# Altium schematic sheet PWM_PART.SchDoc
size A4
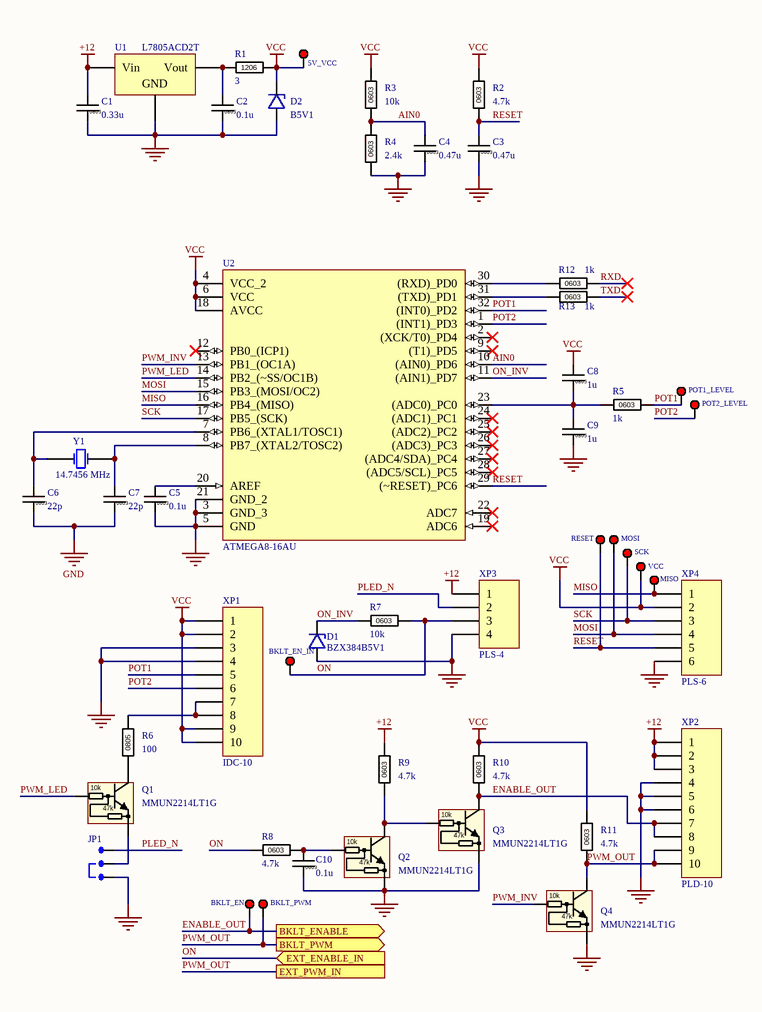
[diagram p0: PWM_PART.SchDoc]

## Parts
C1  Cap: 0.33u  Foot: 0805  [CAP_0805]  (hidden comment: 0805-X7R-100-0.33 мкф K)
C2  Cap: 0.1u  Foot: 0805  [CAP_0805]  (hidden comment: 0805-X7R-50-0.1 мкф K Hitano)
C3  Cap: 0.47u  Foot: 0603  [CAP_0603]  (hidden comment: 0603-X7R-50-0.47 мкф)
C4  Cap: 0.47u  Foot: 0603  [CAP_0603]  (hidden comment: 0603-X7R-50-0.47 мкф)
C5  Cap: 0.1u  Foot: 0603  [CAP_0603]  (hidden comment: 0603-X7R-50-0.1 мкф)
C6  Cap: 22p  Foot: 0603  [CAP_0603]  (hidden comment: 0603-NP0-50-22 пф F)
C7  Cap: 22p  Foot: 0603  [CAP_0603]  (hidden comment: 0603-NP0-50-22 пф F)
C8  Cap: 1u  Foot: 0805  [CAP_0805]  (hidden comment: 0805-X7R-50-1 мкф)
C9  Cap: 1u  Foot: 0805  [CAP_0805]  (hidden comment: 0805-X7R-50-1 мкф)
C10  Cap: 0.1u  Foot: 0603  [CAP_0603]  (hidden comment: 0603-X7R-50-0.1 мкф)
D1  BZX384B5V1  [SOD_323 (SC-76)]
D2  value B5V1  [SOD_323 (SC-76)]  (hidden comment: BZX384B5V1)
JP1  (no value)  [CONN_JUMPER 3PIN 2.54MM]
Q1  MMUN2214LT1G  [SOT_23]
Q2  MMUN2214LT1G  [SOT_23]
Q3  MMUN2214LT1G  [SOT_23]
Q4  MMUN2214LT1G  [SOT_23]
R1  value 3  Foot: 1206  [resistor_1206]  (hidden comment: 1206-3 J)
R2  value 4.7k  Foot: 0603  [resistor_0603]  (hidden comment: 0603-4.7 к J)
R3  value 10k  Foot: 0603  [resistor_0603]  (hidden comment: 0603-10к J)
R4  value 2.4k  Foot: 0603  [resistor_0603]  (hidden comment: 0603-2.4 к F)
R5  value 1k  Foot: 0603  [RESistor_0603]  (hidden comment: 0603-1 к J)
R6  value 100  Foot: 0805  [resistor_0805]  (hidden comment: 0805-100 J)
R7  value 10k  Foot: 0603  [resistor_0603]  (hidden comment: 0603-10к J)
R8  value 4.7k  Foot: 0603  [resistor_0603]  (hidden comment: 0603-4.7 к J)
R9  value 4.7k  Foot: 0603  [resistor_0603]  (hidden comment: 0603-4.7 к J)
R10  value 4.7k  Foot: 0603  [resistor_0603]  (hidden comment: 0603-4.7 к J)
R11  value 4.7k  Foot: 0603  [resistor_0603]  (hidden comment: 0603-4.7 к J)
R12  value 1k  Foot: 0603  [RESistor_0603]  (hidden comment: 0603-1 к J)
R13  value 1k  Foot: 0603  [RESistor_0603]  (hidden comment: 0603-1 к J)
TP1  5V_VCC  [OTHER_SMD_TP_1.5MM]
TP2  MISO  [OTHER_SMD_TP_1.5MM]
TP3  VCC  [OTHER_SMD_TP_1.5MM]
TP4  SCK  [OTHER_SMD_TP_1.5MM]
TP5  MOSI  [OTHER_SMD_TP_1.5MM]
TP6  RESET  [OTHER_SMD_TP_1.5MM]
TP7  BKLT_EN  [OTHER_SMD_TP_1.5MM]
TP8  BKLT_PWM  [OTHER_SMD_TP_1.5MM]
TP9  BKLT_EN_IN  [OTHER_SMD_TP_1.5MM]
TP10  POT1_LEVEL  [OTHER_SMD_TP_1.5MM]
TP11  POT2_LEVEL  [OTHER_SMD_TP_1.5MM]
U1  L7805ACD2T  [D2-PAK]
U2  ATMEGA8-16AU  [TQFP_32]
XP1  IDC-10  [CONN_IDC-10]
XP2  PLD-10  [CONN_PLD-10]
XP3  PLS-4  [CONN_PLS-4]
XP4  PLS-6  [CONN_PLD-6]
Y1  14.7456 MHz  [CRYSTAL_HC-49S]

## Ports
BKLT_ENABLE (out), BKLT_PWM (out), EXT_ENABLE_IN (in), EXT_PWM_IN

## Nets
+12: C1.1 R9.2 U1.1(Vin) XP2.1 XP2.2 XP2.3 XP3.1
GND: C1.2 C2.2 C3.2 C4.2 C5.2 C6.2 C7.2 C9.2 C10.2 D1.A D2.A JP1.1 Q2.2(E) Q3.2(E) Q4.2(E) R4.1 U1.2(GND) U2.3(GND_3) U2.5(GND) U2.21(GND_2) XP1.3 XP1.4 XP2.4 XP2.5 XP2.6 XP3.4 XP4.6
VCC: C8.1 D2.C R1.2 R2.2 R3.2 R10.2 R11.2 TP1.1 TP3.1 U2.4(VCC_2) U2.6(VCC) U2.18(AVCC) XP1.1 XP1.2 XP1.9 XP1.10 XP4.2
AIN0: C4.1 R3.1 R4.2 U2.10((AIN0)_PD6)
ENABLE_OUT: Q3.3(C) R10.1 TP7.1 XP2.7 XP2.8 ; port BKLT_ENABLE
MISO: TP2.1 U2.16(PB4_(MISO)) XP4.1
MOSI: TP5.1 U2.15(PB3_(MOSI/OC2)) XP4.4
ON: R7.2 R8.1 TP9.1 XP3.3 ; port EXT_ENABLE_IN
ON_INV: D1.C R7.1 U2.11((AIN1)_PD7)
PLED_N: JP1.3 XP3.2
POT1: R5.2 TP10.1 U2.32((INT0)_PD2) XP1.5
POT2: TP11.1 U2.1((INT1)_PD3) XP1.6
PWM_INV: Q4.1(B) U2.13(PB1_(OC1A))
PWM_LED: Q1.1(B) U2.14(PB2_(~SS/OC1B))
PWM_OUT: Q4.3(C) R11.1 TP8.1 XP2.9 XP2.10 ; port BKLT_PWM, port EXT_PWM_IN
RESET: C3.1 R2.1 TP6.1 U2.29((~RESET)_PC6) XP4.5
RXD: R12.2
SCK: TP4.1 U2.17(PB5_(SCK)) XP4.3
TXD: R13.2
NetC2_1: C2.1 R1.1 U1.3(Vout)
NetC5_1: C5.1 U2.20(AREF)
NetC6_1: C6.1 U2.7(PB6_(XTAL1/TOSC1)) Y1.1(OSC1)
NetC7_1: C7.1 U2.8(PB7_(XTAL2/TOSC2)) Y1.2(OSC2)
NetC8_2: C8.2 C9.1 R5.1 U2.23((ADC0)_PC0)
NetC10_1: C10.1 Q2.1(B) R8.2
NetJP1_2: JP1.2 Q1.2(E)
NetQ1_3: Q1.3(C) R6.1
NetQ2_3: Q2.3(C) Q3.1(B) R9.1
NetR6_2: R6.2 XP1.7 XP1.8
NetR12_1: R12.1 U2.30((RXD)_PD0)
NetR13_1: R13.1 U2.31((TXD)_PD1)

Not connected (* = marked no-connect by the designer): U2 2((XCK/T0)_PD4)* 9((T1)_PD5)* 12(PB0_(ICP1))* 19(ADC6)* 22(ADC7)* 24((ADC1)_PC1)* 25((ADC2)_PC2)* 26((ADC3)_PC3)* 27((ADC4/SDA)_PC4)* 28((ADC5/SCL)_PC5)*

## Notes on the sheet
- (in symbol MMUN2214LT1G_50V 0.1A 0.25W) 10k; 47k

## Library data of the parts
C1 = 0805-X7R-100-0.33 мкф K: Конденсатор Чип Керамический; Voltage: 100V
C2 = 0805-X7R-50-0.1 мкф K: Конденсатор Чип Керамический; Voltage: 50V
C3 C4 = 0603-X7R-50-0.47 мкф: Конденсатор Чип Керамический; Voltage: 50V
C5 C10 = 0603-X7R-50-0.1 мкф: Конденсатор Чип Керамический; Voltage: 50V; Price, $: 0.1
C6 C7 = 0603-NP0-50-22 пф F: Конденсатор Чип Керамический; Voltage: 50V; Tolerance: 1%
C8 C9 = 0805-X7R-50-1 мкф: Конденсатор Чип Керамический; Voltage: 50V
JP1 = CONN_JUMPER 2.54 MM
Q1-Q4 = MMUN2214LT1G_50V 0.1A 0.25W: NPN Digital Transistor; Published: 17-Sep-2003; DatasheetDocument: Jun-1999; PackageDocument: May-1999; PackageReference: SOT23; Publisher: Altium Limited
R1 = 1206-3 J: Резистор Чип; Power: 0.25W
R2 R8-R11 = 0603-4.7 к J: Резистор Чип; Power: 0.1W; Price, $: 0.015
R3 R7 = 0603-10 к J: Резистор Чип; Power: 0.1W; Price, $: 0.015
R4 = 0603-2.49 к F: Резистор Чип; Power: 0.1W; Tolerance: 1%
R5 R12 R13 = 0603-1 к J: Резистор Чип; Power: 0.1W; Price, $: 0.015
R6 = 0805-100 J: Резистор Чип; Power: 0.125W
TP1-TP11 = Test Point_1.5MM
U1 = LDO_L7805ACD2T-TR: Стабилизатор напряжения +5В 1.5А, [D2-PAK] /; Published: 24-Mar-1999; LatestRevisionDate: 29-May-2009; LatestRevisionNote: IPC-7351 Footprint Added.; PackageReference: D2PAK; Publisher: Altium Limited; PackageDescription: 3-Pin Transistor Outline Package 2.54 mm Pitch, 15.1 mm Lead Span
U2 = MCU_ATMEGA8-16AU: AVR AVRÂ® ATmega Microcontroller IC 8-Bit 16MHz 8KB _4K x 16_ FLASH 32-TQFP _7x7_; MF: Microchip Technology; Package: TQFP-32 Microchip Technology; Value: *; Price: None; MP: ATMEGA8-16AU; SnapEDA_Link: https://www.snapeda.com/parts/ATMEGA8-16AU/Microchip/view-part/4246640/?ref=snap; Availability: Unavailable
XP1 = CONN_IDC-10 (Single Row): Header, 10-Pin; LatestRevisionDate: 17-Jul-2002; LatestRevisionNote: Re-released for DXP Platform.; Publisher: Altium Limited
XP2 = CONN_Header 10 (Single Row)_1: Header, 10-Pin; LatestRevisionDate: 17-Jul-2002; LatestRevisionNote: Re-released for DXP Platform.; Publisher: Altium Limited
XP3 = CONN_PLS-4: Header, 4-Pin; LatestRevisionDate: 17-Jul-2002; LatestRevisionNote: Re-released for DXP Platform.; Publisher: Altium Limited
XP4 = CONN_PLS-6: Header, 6-Pin; LatestRevisionDate: 17-Jul-2002; LatestRevisionNote: Re-released for DXP Platform.; Publisher: Altium Limited
Y1 = CRYSTAL_14.7456 MHz: 14.7456 МГц имп. HC-49SM, Кварцевый резонатор; Published: 8-Jun-2000; LatestRevisionDate: 17-Jul-2002; LatestRevisionNote: Re-released for DXP Platform.; PackageReference: R38; Publisher: Altium Limited; PackageDescription: Crystal, Thru-Hole; 2 Leads; Body 3.1 x 8.2 mm (Dia.xH)
D1 D2 = BZX384B5V1: Price, $: 0.3; HelpURL: L:\Dev\Техническая документация\Стабилитроны\BZX384_series_Vishay.pdf
  D1: Value: BZX384B5V1